# Altium project Laser Power Meter.PrjPcb
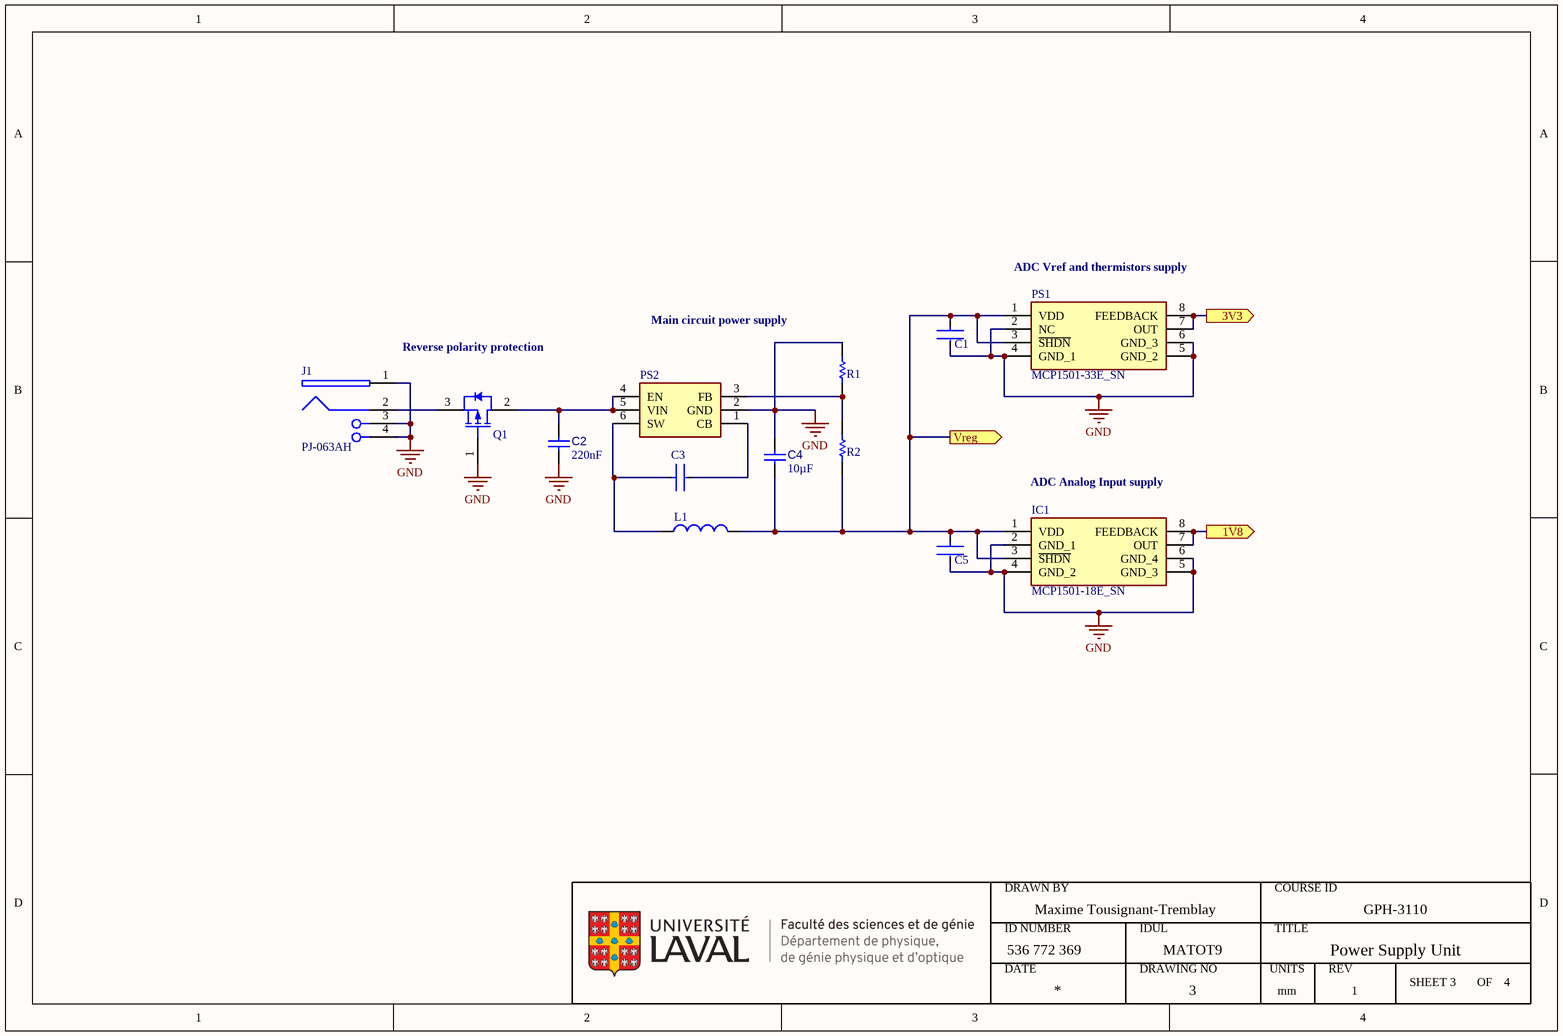
[diagram p0: Power Supply Unit.SchDoc]
Units: mm; SCH_REV: A; PCB_REV: A; PCB_PART_NUMBER: <PCB PN>; PCB_ENGINEER_APP_DATE: --/--/----; PCB_ENGINEER: - -----; PCB_DWG_NO: <PCB DWG NO>; PCB_DESIGNER_APP_DATE: --/--/----; PCB_DESIGNER: - -----; PCB_CHECKER_APP_DATE: --/--/----; PCB_CHECKER: - -----; PCB_ASSEMBLY_NO: <PCB ASSY NO>; PCB_ANG_TOL: +/-1/2; PCB_3_DEC_TOL: +/-.010; PCB_2_DEC_TOL: +/-.01; IDUL: MATOT9; ID Number: 536 772 369; DrawnBy: Maxime Tousignant-Tremblay; DOC_NO_SCH_DWG: <SCH DWG NO>; DOC_NO_FAB_DWG: <FAB DWG NO>; DOC_NO_BOM: <BOM DOC NO>; DOC_NO_ASSY_DWG: <ASSY DWG NO>; CourseID: GPH-3110; CONTRACT_NUMBER: <CONTRACT NO>; CAGE_CODE: ?????
6 sheets, 85 parts. Net scope: flat (ports and power ports of the same name join across sheets).
Board file: Design III.PcbDoc
Sheets:
  Power Supply Unit.SchDoc
  Instrumentation Amplifier Design.SchDoc
  Analog Filter-ADC interface.SchDoc
  All in One.SchDoc
  Weatstone Bridge Design.SchDoc
  Voltage Divider Design.SchDoc

## Sheet Power Supply Unit.SchDoc: Power Supply Unit
size A4; DrawnBy: Maxime Tousignant-Tremblay; DocumentNumber: GPH-3110-1; Revision: 1; SheetNumber: 3; SheetTotal: 4; SPICEModelCacheSEIOAEZJ: <root> / <DocumentId>SEIOAEZJ</DocumentId> / </root>

### Parts
(Parts that share a designator on the sheet are numbered #1, #2 ... from top to bottom, then left to right.)
*1#1  ULaval FSG-DPGPO  (value not drawn)
C1#1  CL10A225KO8NNNC  [FP-CL10-IPC_A]  (value not drawn)
C2#1  value 220nF  [CAPC0402(1005)60_L]  (hidden comment: Capacitor 220nF +/-20% 10V 0402)
C3#1  CC0603KRX7R9BB104  [FP-CC0603-DA-MFG]  (value not drawn)
C4#1  value 10µF  [CAPC2013X135X45NL10T25]  (hidden comment: Capacitor 10 uF +/- 10% 16 V 0805)
C5#1  CL10A225KO8NNNC  [FP-CL10-IPC_A]  (value not drawn)
IC1  MCP1501-18E_SN  [SOIC127P600X175-8N]
J1#1  PJ-063AH  [CUI-PJ-063AH_V]
L1#1  7447916  [SMD-1210]  (value not drawn)
PS1  MCP1501-33E_SN  [SOIC127P600X175-8N]
PS2  LMR50410YFQDBVRQ1  [SOT95P280X145-6N]  (value not drawn)
Q1#1  IPD90P03P4-04  [INF-PG-TO252-3-11_N]  (value not drawn)
R1#1  RC0402FR-1322K1L  [RESC1005X40X25ML05T10]  (value not drawn)
R2#1  RC0402FR-0788K7L  [RESC1005X40X25NL05T10]  (value not drawn)

### Ports
1V8 (out, see Processing interface[1A], Processing interface[1B], Processing interface[1C], Processing interface[4A], Processing interface[4B], Processing interface[4C]), 3V3 (out, see Processing interface[1A], Processing interface[1B], Processing interface[1C], Processing interface[4A], Processing interface[4B], Processing interface[4C], Weatstone bridge[2B]), Vreg (out, see Processing interface[1A], Processing interface[1B], Processing interface[1C], Processing interface[3C], Processing interface[4A], Processing interface[4B], Processing interface[4C], Processing interface[4D], Weatstone bridge[2B], Weatstone bridge[2C], Weatstone bridge[3B])

### Nets
GND: C1#1.2 C2#1.2 C4#1.2 C5#1.2 IC1.2(GND_1) IC1.4(GND_2) IC1.5(GND_3) IC1.6(GND_4) J1#1.1 J1#1.3(SHLD) J1#1.4(SHLD) PS1.2(NC) PS1.4(GND_1) PS1.5(GND_2) PS1.6(GND_3) PS2.2(GND) Q1#1.1(GATE) R1#1.2
NetC1#1_1: C1#1.1 C4#1.1 C5#1.1 IC1.1(VDD) IC1.3(~{SHDN}) L1#1.2 PS1.1(VDD) PS1.3(~{SHDN}) R2#1.1 ; port Vreg
NetC2#1_1: C2#1.1 PS2.4(EN) PS2.5(VIN) Q1#1.2(DRAIN)
NetC3#1_1: C3#1.1 L1#1.1 PS2.6(SW)
NetC3#1_2: C3#1.2 PS2.1(CB)
NetIC1_7: IC1.7(OUT) IC1.8(FEEDBACK) ; port 1V8
NetJ1#1_2: J1#1.2 Q1#1.3(SOURCE)
NetPS1_7: PS1.7(OUT) PS1.8(FEEDBACK) ; port 3V3
NetPS2_3: PS2.3(FB) R1#1.1 R2#1.2

### Notes on the sheet
- (near PS1) ADC Vref and thermistors supply
- Reverse polarity protection
- Main circuit power supply
- (near IC1) ADC Analog Input supply
- (in symbol ULaval FSG-DPGPO) DRAWN BY; COURSE ID; ID NUMBER; IDUL; TITLE; DATE; DRAWING NO; UNITS; REV; SHEET; OF

### Library data of the parts
C1#1 C5#1 = CMP-13271-000835-1: Cap Ceramic 2.2uF 16V X5R ±10% Pad SMD 0603 +85°C T/R; Case Code (Metric): 1608; Height: 0.8mm; Case/Package: 0603; Depth: 0.8mm; Capacitance: 2.2uF; Voltage Rating: 16V; Case Code (Imperial): 0603; Length: 1.6mm; Packaging: Tape and Reel; Material: Ceramic; Lead Free: Lead Free; Max Operating Temperature: 85°C; Contact Plating: Tin; Thickness: 0.035inch; Radiation Hardening: No; Tolerance: 10%; Min Operating Temperature: -55°C; Voltage: 16V; Dielectric: X5R; Mount: Surface Mount; Package Quantity: 4000; Width: 0.031inch; Voltage Rating (DC): 16V
C2#1 = CMP-001-00057-3: Chip Capacitor, 220nF +/-20%, 10V, 0402, Thickness 0.6 mm; Tolerance: 10%; Max Operating Temperature: 85°C; Pins: 2; Case/Package: 0402; Mounting Technology: SMT; Voltage Rating: 10V; Min Operating Temperature: -55°C
C3#1 = CMP-2100-03601-2: CAP CER 0.1UF 50V X7R 0603; Manufacturer: YAGEO; Material: Ceramic; Capacitance: 100 nF; Temperature Coefficient: 15%; Tolerance: 0.1; Value: 100 nF; Description: CC0603 100 nF X7R 10.00% 50 V; Height: 0.9mm; Voltage: 50 V; ComponentLink2Description: Datasheet; Device Class L2: Capacitors; Temperature Range High: +125°C; Category: Cap; Footprint Url: http://www.yageo.com/exep/pages/download/literatures/UPY-C_GEN_24.pdf; ComponentLink2URL: http://www.yageo.com/documents/recent/UPY-GPHC_X7R_6.3V-to-50V_18.pdf; Package: CC0603-DA; Temperature: -55°C to +125°C; Voltage Rating: 50 V; Temperature Characteristic: X7R; Device Class L1: Passive Components; Temperature Range Low: -55°C; Manufacturer Part Number: CC0603KRX7R9BB104; RoHS: TRUE; Automotive: No; Device Class L3: Ceramic Capacitors; Octopart: https://octopart.com/cc0603krx7r9bb104-yageo-42244635; Mouser Description: Multilayer Ceramic Capacitor, CC Series, 0.1 - F, - 10%, X7R, 50 V, 0603 [1608 Metric]; Lead Free: Yes; Digikey Description: CAP CER 0.1UF 50V X7R 0603
C4#1 = CMP-001-00015-6: Chip Capacitor, 10 uF, +/- 10%, 16 V, 0805 (2012 Metric); Voltage Rating: 16V; Capacitor Type: Ceramic; RoHS Compliant: True; Max Operating Temperature: 85°C; Min Operating Temperature: -55°C; Mounting Technology: SM; Tolerance: 10%; Case/Package: 0805; Pins: 2
IC1 = MCP1501-18E_SN: Integrated Circuit; Manufacturer_Name: Microchip; Manufacturer_Part_Number: MCP1501-18E/SN; Datasheet Link: http://ww1.microchip.com/downloads/en/DeviceDoc/20005474E.pdf; Height: 1.75mm; Mouser Part Number: 579-MCP1501-18E/SN; Mouser Price/Stock: https://www.mouser.co.uk/ProductDetail/Microchip-Technology-Atmel/MCP1501-18E-SN?qs=BA62vJVifGrqbCLW75KQyA%3D%3D; Arrow Part Number: MCP1501-18E/SN; Arrow Price/Stock: https://www.arrow.com/en/products/mcp1501-18esn/microchip-technology?region=nac
J1#1 = CMP-2000-06898-1: Through Hole Right Angle DC Power Jack, 8 A, 2 mm Center Pin, 2 Position, -25 to 85 degC, RoHS, Bulk; Manufacturer: CUIInc.; Voltage Rating: 24V; Current Rating: 8A; Inside Contact Diameter: 2mm; Insulation Resistance: 100MOhms; Outside Contact Diameter: 6.5mm; Brand: CUI; Termination Style: ThroughHole; Flammability Rating: UL94V-0; Datasheet Version: Rev. 1.02, 03/2016; Manufacturer URL: http://www.cui.com/; Product Category: DCPowerConnectors; Package Description: 2-Pin Through Hole Device, Body 13 x 10 mm, Height 9 mm; Connector Type: DCPowerJack; Factory Pack Quantity: 500; Contact Plating: Nickel; Mounting Style: KinkedPin; Contact Material: Copper; RoHS: True; Mounting Angle: Right; Package Reference: PJ-063AH; Product: Jacks; Contact Gender: Male; Datasheet URL: http://www.cui.com/product/resource/pj-063ah.pdf; Housing Material: PolybutyleneTerephthalate(PBT); Mounting Technology: ThroughHole; Operating Temperature Range: -25Cto+85C
L1#1 = CMP-0221-00031-1: SMD-Multilayer Inductor WE-MI, L = 4.70 µH; Inductance: 4.70 ÂµH; ComponentLink2Description: Datasheet; PackageReference: SMD-1210; ComponentLink1Description: Manufacturer Link; PackageDescription: Chip Inductor, 2-Leads, Body 3.2 x 2.5 mm; PackageVersion: 2007; ComponentLink1URL: http://www.we-online.com; DatasheetVersion: ver 5, Oct-2004; ComponentLink2URL: http://www.we-online.de/katalog/media/pdf/7447916.pdf
PS1 = MCP1501-33E_SN: Power Supply; Manufacturer_Name: Microchip; Manufacturer_Part_Number: MCP1501-33E/SN; Datasheet Link: http://www.farnell.com/datasheets/2158574.pdf; Height: 1.75mm; Mouser Part Number: 579-MCP1501-33E/SN; Mouser Price/Stock: https://www.mouser.co.uk/ProductDetail/Microchip-Technology-Atmel/MCP1501-33E-SN?qs=BA62vJVifGoOZffNI8tq9A%3D%3D; Arrow Part Number: MCP1501-33E/SN; Arrow Price/Stock: https://www.arrow.com/en/products/mcp1501-33esn/microchip-technology?region=nac
PS2 = LMR50410YFQDBVRQ1: Power Supply; Manufacturer_Name: Texas Instruments; Datasheet Link: https://www.ti.com/product/LMR50410-Q1; Height: 1.45mm; Manufacturer_Part_Number: LMR50410YFQDBVRQ1; Mouser Part Number: 595-MR50410YFQDBVRQ1; Mouser Price/Stock: https://www.mouser.co.uk/ProductDetail/Texas-Instruments/LMR50410YFQDBVRQ1?qs=81r%252BiQLm7BRUAgUFqYZycA%3D%3D; Arrow Part Number: LMR50410YFQDBVRQ1; Arrow Price/Stock: https://www.arrow.com/en/products/lmr50410yfqdbvrq1/texas-instruments?region=nac
Q1#1 = CMP-013-00034-1: Single P-Channel 30 V 4.5 mOhm 100 nC OptiMOS Power Mosfet - TO-252-3-11; Gate to Source Voltage (Vgs): 20V; Input Capacitance: 10.3nF; Rds On Max: 4.5mR; Drain to Source Breakdown Voltage: 30V; Power Dissipation: 137W; Max Dual Supply Voltage: -30V; Continuous Drain Current (ID): 90A; Turn-Off Delay Time: 70ns; Halogen Free: Halogen Free; Min Operating Temperature: -55°C; RoHS Compliant: Yes; Max Operating Temperature: 175°C; Pins: 3; Lead Free: Lead Free; Packaging: Tape and Reel; Package Quantity: 1; Reach SVHC Compliant: Yes; Drain to Source Voltage (Vdss): -30V; Max Power Dissipation: 137W; Element Configuration: Single; Drain to Source Resistance: 4.5mR; Series: OptiMOS™; Case/Package: TO-252-3
R1#1 = CMP-2002-07868-1: Manufacturer: Yageo / Phycomp; Part Number: RC0402FR-1322K1L
R2#1 = CMP-2002-07828-1: Manufacturer: Yageo; Part Number: RC0402FR-0788K7L

## Sheet Instrumentation Amplifier Design.SchDoc: Instrumentation Amplifier Design
size A4; DocumentNumber: GPH-3110-5; Revision: 1; SheetNumber: 2; SheetTotal: 6
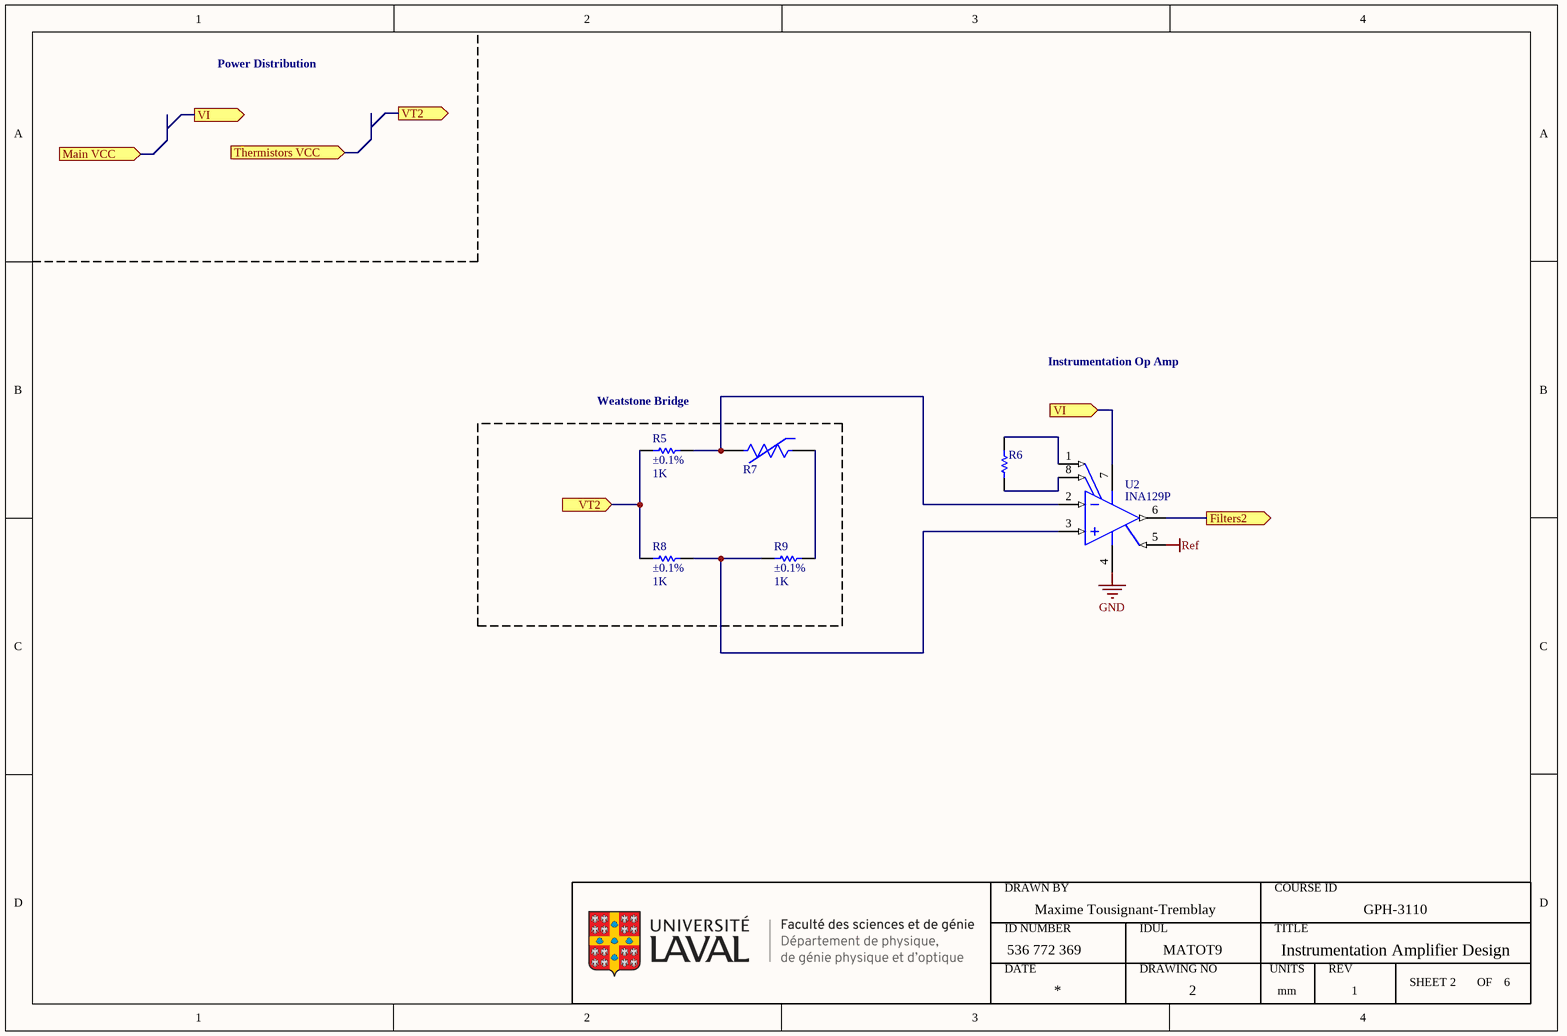
[diagram p1: Instrumentation Amplifier Design.SchDoc]

### Parts
(Parts that share a designator on the sheet are numbered #1, #2 ... from top to bottom, then left to right.)
*2  ULaval FSG-DPGPO  (value not drawn)
R5#1  value 1K  TC: ±0.1%  (hidden comment: Resistor)
R6#1  Resistor  (value not drawn)
R7#1  TMP6131DYAT  [FP-DYA0002A-MFG]  (value not drawn)
R8#1  value 1K  TC: ±0.1%  (hidden comment: Resistor)
R9#1  value 1K  TC: ±0.1%  (hidden comment: Resistor)
U2#1  INA129P  [P0008A]

### Blocks framed on the sheet
Weatstone Bridge: R5#1 R7#1 R8#1 R9#1

### Ports
Filters2 (out), Main VCC (in), Thermistors VCC (in), VI (in), VI (out), VT2 (in), VT2 (out)

### Nets
GND: U2#1.4(V-)
Ref: U2#1.5(REF)
NetR5#1_1: R5#1.1 R7#1.1(-) U2#1.2(VIN-)
NetR5#1_2: R5#1.2 R8#1.2 ; port VT2
NetR6#1_1: R6#1.1 U2#1.8(RG)
NetR6#1_2: R6#1.2 U2#1.1(RG)
NetR7#1_2: R7#1.2(+) R9#1.1
NetR8#1_1: R8#1.1 R9#1.2 U2#1.3(VIN+)
NetU2#1_6: U2#1.6(VO) ; port Filters2
NetU2#1_7: U2#1.7(V+) ; port VI

### Notes on the sheet
- Power Distribution
- Instrumentation Op Amp
- (in symbol ULaval FSG-DPGPO) DRAWN BY; COURSE ID; ID NUMBER; IDUL; TITLE; DATE; DRAWING NO; UNITS; REV; SHEET; OF

### Library data of the parts
R5#1 R8#1 R9#1 = Resistor: TC1: 0; SimulationGenericComponent: True; TC2: 0
R6#1 = Resistor: TC1: 0; SimulationGenericComponent: True; Value: 1K; TC2: 0
R7#1 = CMP-009-00177-1: ±1% tolerance 10kΩ linear thermistor available in 0402 and 0603 package options 2-SOT-5X3 -40 to 125; Max Operating Temperature: 125°C; Mounting Technology: Surface Mount; Min Operating Temperature: -40°C; Series: -; Resistance Tolerance: 1%
U2#1 = CMP-014-00009-1: Precision, Low Power Instrumentation Amplifiers 8-PDIP; Common Mode Rejection Ratio: 120dB; Supply Current: 750uA; -3db Bandwidth: 1.3MHz; Input Bias Current: 5nA; Output Current per Channel: 15mA; Number of Channels: 1; Input Voltage Noise Density: 8nV/sqrt Hz; Input Resistance: 100GR; Voltage Gain: 80dB; Number of Elements: 3; Dual Supply Voltage: 15V; Slew Rate: 4V/µs; Min Dual Supply Voltage: 2.25V; Max Dual Supply Voltage: 18V; Operating Supply Current: 700uA; Min Supply Voltage: 4.5V; Input Offset Voltage (Vos): 50uV; Max Supply Voltage: 36V; RoHS Compliant: Yes; Min Operating Temperature: -40°C; Gain Bandwidth Product: 1.3MHz; Weight: 0.018646oz; Length: 9.81mm; Width: 6.35mm; Series: INA129; Pins: 8; Max Operating Temperature: 125°C; Number of Amplifiers: 1; Nominal Supply Current: 750uA; Packaging: Rail/Tube; Bandwidth: 1.3MHz; Height: 4.57mm; Case/Package: P; Lead Free: Lead Free; Quiescent Current: 700uA; Reach SVHC Compliant: Yes; Package Quantity: 50; Number of Circuits: 1; Radiation Hardening: No

## Sheet Analog Filter-ADC interface.SchDoc: Analog Filter-ADC interface
size A4; DocumentNumber: GPH-3110-3; Revision: 1; SheetNumber: 3; SheetTotal: 6; SPICEModelCacheINAKYIWR: <root> / <DocumentId>INAKYIWR</DocumentId> / </root>
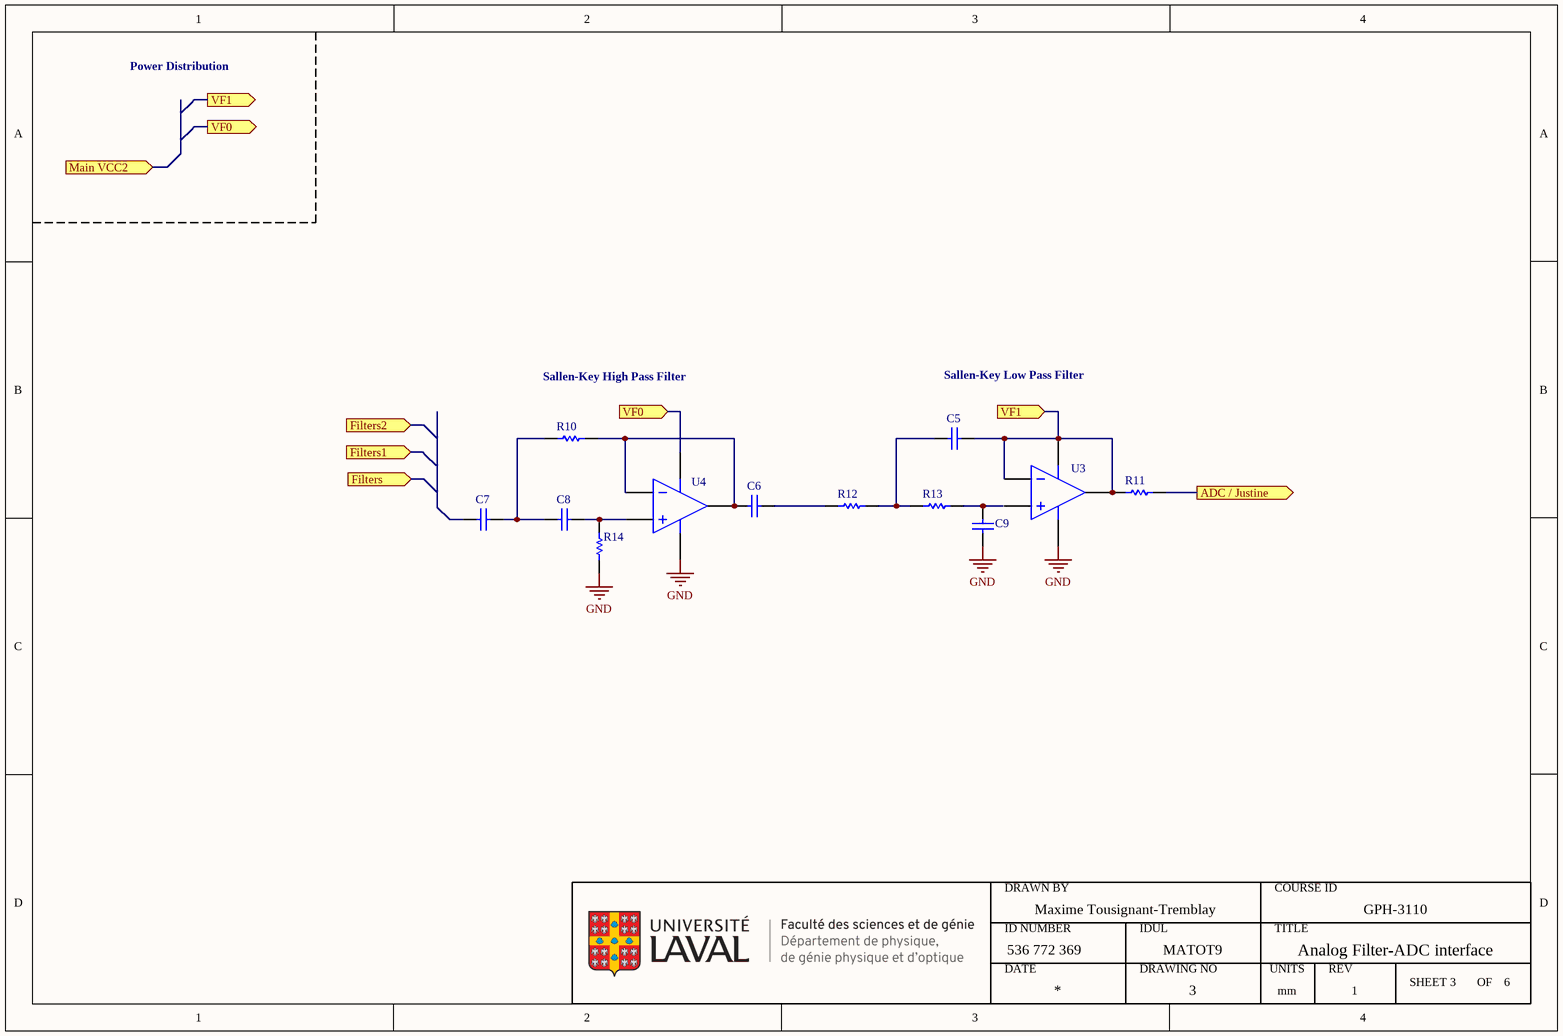
[diagram p2: Analog Filter-ADC interface.SchDoc]

### Parts
(Parts that share a designator on the sheet are numbered #1, #2 ... from top to bottom, then left to right.)
*3  ULaval FSG-DPGPO  (value not drawn)
C5#2  Capacitor  (value not drawn)
C6  Capacitor  (value not drawn)
C7  Capacitor  (value not drawn)
C8  Capacitor  (value not drawn)
C9  Capacitor  (value not drawn)
R10  Resistor  (value not drawn)
R11  Resistor  (value not drawn)
R12  Resistor  (value not drawn)
R13  Resistor  (value not drawn)
R14  Resistor  (value not drawn)
U3#1  Ideal Operational Amplifier  (value not drawn)
U4  Ideal Operational Amplifier  (value not drawn)

### Ports
ADC / Justine (out), Filters1 (in), Filters2 (in), Filters (in), Main VCC2 (in), VF0 (in), VF0 (out), VF1 (in), VF1 (out)

### Nets
GND: C9.2 R14.1 U3#1.5(V-) U4.5(V-)
NetC5#2_1: C5#2.1 R12.2 R13.2
NetC5#2_2: C5#2.2 R11.2 U3#1.1(IN-) U3#1.3(OUT) U3#1.4(V+) ; port VF1
NetC6_1: C6.1 R12.1
NetC6_2: C6.2 R10.2 U4.1(IN-) U4.3(OUT)
NetC7_2: C7.2 C8.1 R10.1
NetC8_2: C8.2 R14.2 U4.2(IN+)
NetC9_1: C9.1 R13.1
NetR11_1: R11.1 ; port ADC / Justine
NetU4_4: U4.4(V+) ; port VF0

Not connected (* = marked no-connect by the designer): C7 1; U3#1 2(IN+)

### Notes on the sheet
- Power Distribution
- Sallen-Key High Pass Filter
- Sallen-Key Low Pass Filter
- (in symbol ULaval FSG-DPGPO) DRAWN BY; COURSE ID; ID NUMBER; IDUL; TITLE; DATE; DRAWING NO; UNITS; REV; SHEET; OF

### Library data of the parts
C5#2 C6-C9 = Capacitor: SimulationGenericComponent: True; Value: 1p
R10-R14 = Resistor: as R6#1 on sheet Instrumentation Amplifier Design; TC2: 0
U3#1 U4 = OpAmp with power terminals: SimulationGenericComponent: True; GAIN: 1

## Sheet All in One.SchDoc: All in One
size A4; Revision: 1; SheetNumber: 2; SheetTotal: 3; SPICEModelCacheWHRBMNBV: <root> / <DocumentId>WHRBMNBV</DocumentId> / <CacheFrame Number="0"> / <Model Name="pmos" Kind="MDL"> / <Text>*Default P-Channel MOSFET / *Pinout: D,G,S / .MODEL PMOS PMOS()</Text> / </Model> / </CacheFrame> / </root>
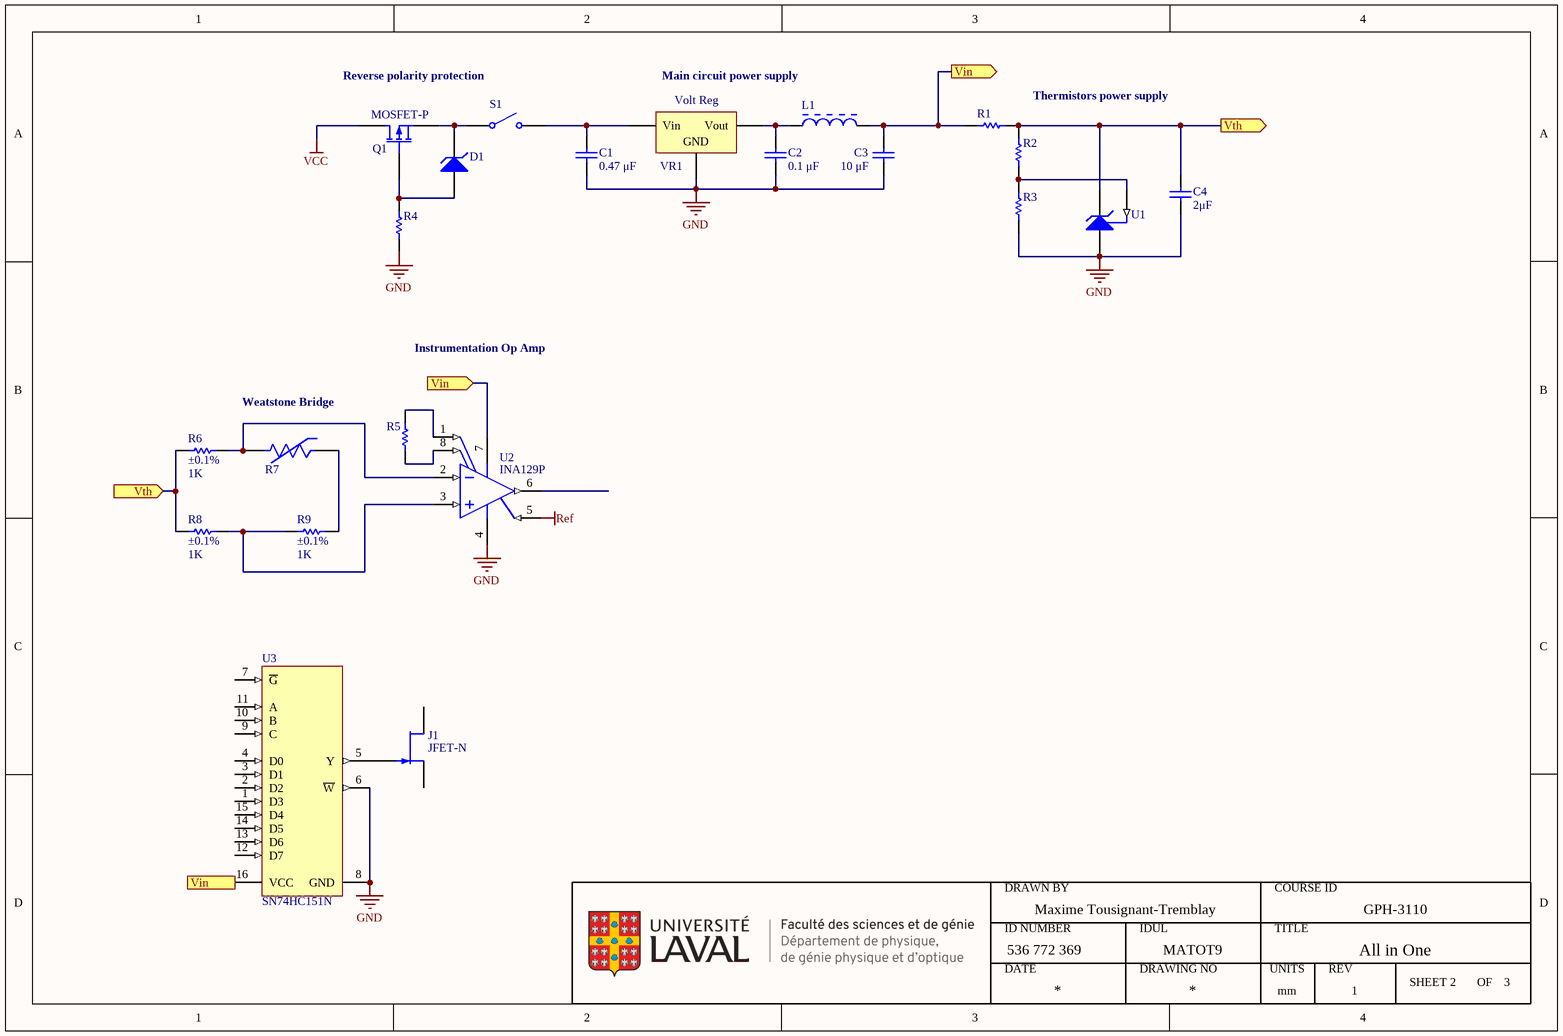
[diagram p3: All in One.SchDoc]

### Parts
(Parts that share a designator on the sheet are numbered #1, #2 ... from top to bottom, then left to right.)
*1#2  ULaval FSG-DPGPO  (value not drawn)
C1#2  value 0.47 μF  (hidden comment: Capacitor)
C2#2  value 0.1 μF  (hidden comment: Capacitor)
C3#2  value 10 μF  (hidden comment: Capacitor)
C4#2  value 2μF  (hidden comment: Capacitor)
D1  Zener Diode  (value not drawn)
J1#2  JFET-N
L1#2  BL01RN1A1D2B  [INDA65-500X360]  (value not drawn)
Q1#2  MOSFET-P  [E3]
R1#2  Resistor  (value not drawn)
R2#2  Resistor  (value not drawn)
R3  Resistor  (value not drawn)
R4  Resistor  (value not drawn)
R5#2  Resistor  (value not drawn)
R6#2  value 1K  TC: ±0.1%  (hidden comment: Resistor)
R7#2  TMP6131DYAT  [FP-DYA0002A-MFG]  (value not drawn)
R8#2  value 1K  TC: ±0.1%  (hidden comment: Resistor)
R9#2  value 1K  TC: ±0.1%  (hidden comment: Resistor)
S1  Single-Pole, Single-Throw Switch  (value not drawn)
U1  TL431AILPR  [LP0003A]  (value not drawn)
U2#2  INA129P  [P0008A]
U3#2  SN74HC151N  [N0016A]
VR1  Volt Reg  [D2PAK_N]

### Ports
Vin (in, see All in One[1D], All in One[3A]), Vin (in, see All in One[2B], All in One[3A]), Vin (out, see All in One[1D], All in One[2B]), Vth (in, see All in One[4A]), Vth (out, see All in One[1B])

### Nets
GND: C1#2.1 C2#2.1 C3#2.1 C4#2.1 R3.1 R4.1 U1.2(ANODE) U2#2.4(V-) U3#2.6(~{W}) U3#2.8(GND) VR1.2(GND)
Ref: U2#2.5(REF)
VCC: Q1#2.1(D)
NetC1#2_2: C1#2.2 S1.2 VR1.1(Vin)
NetC2#2_2: C2#2.2 L1#2.1 VR1.3(Vout)
NetC3#2_2: C3#2.2 L1#2.2 R1#2.2 U2#2.7(V+) U3#2.16(VCC) ; port Vin
NetC4#2_2: C4#2.2 R1#2.1 R2#2.2 R6#2.2 R8#2.2 U1.3(CATHODE) ; port Vth
NetD1_1: D1.1(A) Q1#2.2(G) R4.2
NetD1_2: D1.2(K) Q1#2.3(S) S1.1
NetJ1#2_2: J1#2.2(G) U3#2.5(Y)
NetR2#2_1: R2#2.1 R3.2 U1.1(REF)
NetR5#2_1: R5#2.1 U2#2.8(RG)
NetR5#2_2: R5#2.2 U2#2.1(RG)
NetR6#2_1: R6#2.1 R7#2.1(-) U2#2.2(VIN-)
NetR7#2_2: R7#2.2(+) R9#2.1
NetR8#2_1: R8#2.1 R9#2.2 U2#2.3(VIN+)

Not connected (* = marked no-connect by the designer): J1#2 1(D) 3(S); U2#2 6(VO); U3#2 1(D3) 2(D2) 3(D1) 4(D0) 7(~{G}) 9(C) 10(B) 11(A) 12(D7) 13(D6) 14(D5) 15(D4)

### Notes on the sheet
- Reverse polarity protection
- Main circuit power supply
- Thermistors power supply
- Instrumentation Op Amp
- Weatstone Bridge
- (in symbol ULaval FSG-DPGPO) DRAWN BY; COURSE ID; ID NUMBER; IDUL; TITLE; DATE; DRAWING NO; UNITS; REV; SHEET; OF

### Library data of the parts
C1#2 C2#2 C3#2 C4#2 = Capacitor: SimulationGenericComponent: True
D1 = Zener Diode: AF: 1; BV_MAX: 1e99; CJO: 0; EG: 1.11; FC: 0.5; IBV: 0.001; IS: 1e-14; MJSW: 0.33; NTUN: 30; TNOM: 27; XTI: 3; SimulationGenericComponent: True; BV: 100; CJP: 0; CTA: 0; CTP: 0; FCS: 0.5; FV_MAX: 1e99; IKF: 0; IKR: 0; ISR: 1e-14; JSW: 0; JTUN: 0; JTUNSW: 0; KEG: 1; KF: 0; LEVEL: 1; N: 1; NBV: 1; NR: 1; NS: 1; PHP: 1; RS: 0; TCV: 0; TLEV: 0; TLEVC: 0; TM1: 0; TM2: 0; TPB: 0; TPHP: 0; TRS: 0; TRS2: 0; TT: 0; TTT1: 0; TTT2: 0; VJ: 1; XTITUN: 3
J1#2 = JFET N-ch Level1: N-channel Junction gate Field-Effect Transistor Level1; AF: 1; BETA: 0.0001; BEX: 0; FC: 0.5; IS: 1e-14; NLEV: 2; TNOM: 27; VT0: -2; SimulationGenericComponent: True; B: 1; CGD: 0; CGS: 0; GDSNOI: 1; KF: 0; LAMBDA: 0; PB: 1; RD: 0; RS: 0; TCV: 0
L1#2 = CMP-006-00003-3: EMI Suppression Filter (Lead Type EMIFIL(R)), 7 A, -40 to 85 degC, 2-Pin THD, RoHS, Bulk; Manufacturer: Murata; Impedance: 50Ohm; Current Rating: 7A; Core Material: Ferrite; Packaging: Bulk; Package Reference: INDA65-500X360; Case/Package: Axial; Datasheet URL: http://www.murata.com/en-us/products/productdata/8796738977822/ENFA0005.pdf; Package Quantity: 500; Diameter: 3.6mm; Datasheet Version: May-16; Min Operating Temperature: -40°C; Mounting Technology: TH; RoHS Compliant: True; Package Description: 2-Pin Axial Lead, Dia 3.6 mm, Body Length 5 mm; Max Operating Temperature: 85°C; Pins: 2; Max Current Rating: 7A
Q1#2 = MOSFET-P: P-Channel MOSFET; Published: 8-Jun-2000; LatestRevisionDate: 17-Jul-2002; LatestRevisionNote: Re-released for DXP Platform.; PackageVersion: 1995/1996; PackageReference: E3; Publisher: Altium Limited; PackageDescription: TO, Flat Index; 3 In-Line, Axial Leads; Body Dia. 4.6mm; Lead Dia. 0.5 mm (max)
R1#2 R2#2 R3 R4 R5#2 = Resistor: as R6#1 on sheet Instrumentation Amplifier Design; TC2: 0
R6#2 R8#2 R9#2 = Resistor: TC1: 0; SimulationGenericComponent: True; TC2: 0
R7#2 = CMP-009-00177-1: as R7#1 on sheet Instrumentation Amplifier Design; Max Operating Temperature: 125°C; Mounting Technology: Surface Mount; Min Operating Temperature: -40°C; Series: -; Resistance Tolerance: 1%
S1 = SPST SW: closed: 0; Rclosed: 1m; Ropen: 1Meg; SimulationGenericComponent: True
U1 = CMP-019-00054-1: IC VREF SHUNT ADJ TO92-3; Max Output Voltage: 36V; Cathode Current: 700uA; Max Output current: 100mA; Min Input Voltage: 2.495V; Temperature Coefficient: 92ppm/°C; Max Supply Voltage: 37V; Reference Type: Shunt,Adjustable; Tolerance: 1%; Number of Channels: 1; Max Operating Temperature: 125°C; Reach SVHC Compliant: Yes; Weight: 0.00752oz; Case/Package: TO-92-3; RoHS Compliant: Yes; Packaging: Tape and Reel; Lead Free: Lead Free; Package Quantity: 1; Output Voltage: 36V; Output Current: 100mA; Series: -; Reference Voltage: 36V; Min Operating Temperature: -40°C; Pins: 3
U2#2 = CMP-014-00009-1: as U2#1 on sheet Instrumentation Amplifier Design; RoHS Compliant: Yes; Min Operating Temperature: -40°C; Gain Bandwidth Product: 1.3MHz; Weight: 0.018646oz; Length: 9.81mm; Width: 6.35mm; Series: INA129; Pins: 8; Max Operating Temperature: 125°C; Number of Amplifiers: 1; Nominal Supply Current: 750uA; Packaging: Rail/Tube; Bandwidth: 1.3MHz; Height: 4.57mm; Case/Package: P; Lead Free: Lead Free; Quiescent Current: 700uA; Reach SVHC Compliant: Yes; Package Quantity: 50; Number of Circuits: 1; Radiation Hardening: No
U3#2 = CMP-016-00010-1: Multiplexer 1-Element CMOS 8-IN 16-Pin PDIP Tube / IC 8-TO-1 DATA SEL/MUX 16-DIP; Max Supply Voltage: 6V; Propagation Delay: 47ns; Independent Circuits: 1; Number of Input Lines: 8; Operating Supply Voltage: 5V; Bandwidth: 28MHz; Low Level Output Current: 7.8mA; Supply Type: Single; Min Supply Voltage: 2V; Polarity: Non-Inverting; Lead Free: Lead Free; Logic Function: Multiplexer; Height: 4.57mm; Radiation Hardening: No; Pins: 16; Number of Channels: 1; Number of Circuits: 1; Number of Inputs: 8; Number of Output Lines: 1; Weight: 0.03357oz; Mounting Technology: Through Hole; Package Quantity: 25; Min Operating Temperature: -40°C; Number of Bits: 8; Number of Outputs: 1; RoHS Compliant: Yes; Max Operating Temperature: 85°C; Series: 74HC; Width: 6.35mm; Reach SVHC Compliant: Yes; High Level Output Current: 7.8mA; Case/Package: PDIP; Packaging: Rail/Tube; Length: 19.3mm
VR1 = Volt Reg: Voltage Regulator; Published: 24-Mar-1999; LatestRevisionDate: 29-May-2009; LatestRevisionNote: IPC-7351 Footprint Added.; PackageReference: D2PAK; Publisher: Altium Limited; PackageDescription: 3-Pin Transistor Outline Package 2.54 mm Pitch, 15.1 mm Lead Span

## Sheet Weatstone Bridge Design.SchDoc: Weatstone Bridge Design
size A4; DocumentNumber: GPH-3110-4; Revision: 1; SheetNumber: 5; SheetTotal: 6; SPICEModelCacheOCUZZWQD: <root> / <DocumentId>OCUZZWQD</DocumentId> / <CacheFrame Number="0"> / <Model Name="nmos" Kind="MDL"> / <Text>*Default N-Channel MOSFET / *Pinout: D,G,S / .MODEL NMOS NMOS()</Text> / </Model> / </CacheFrame> / </root>
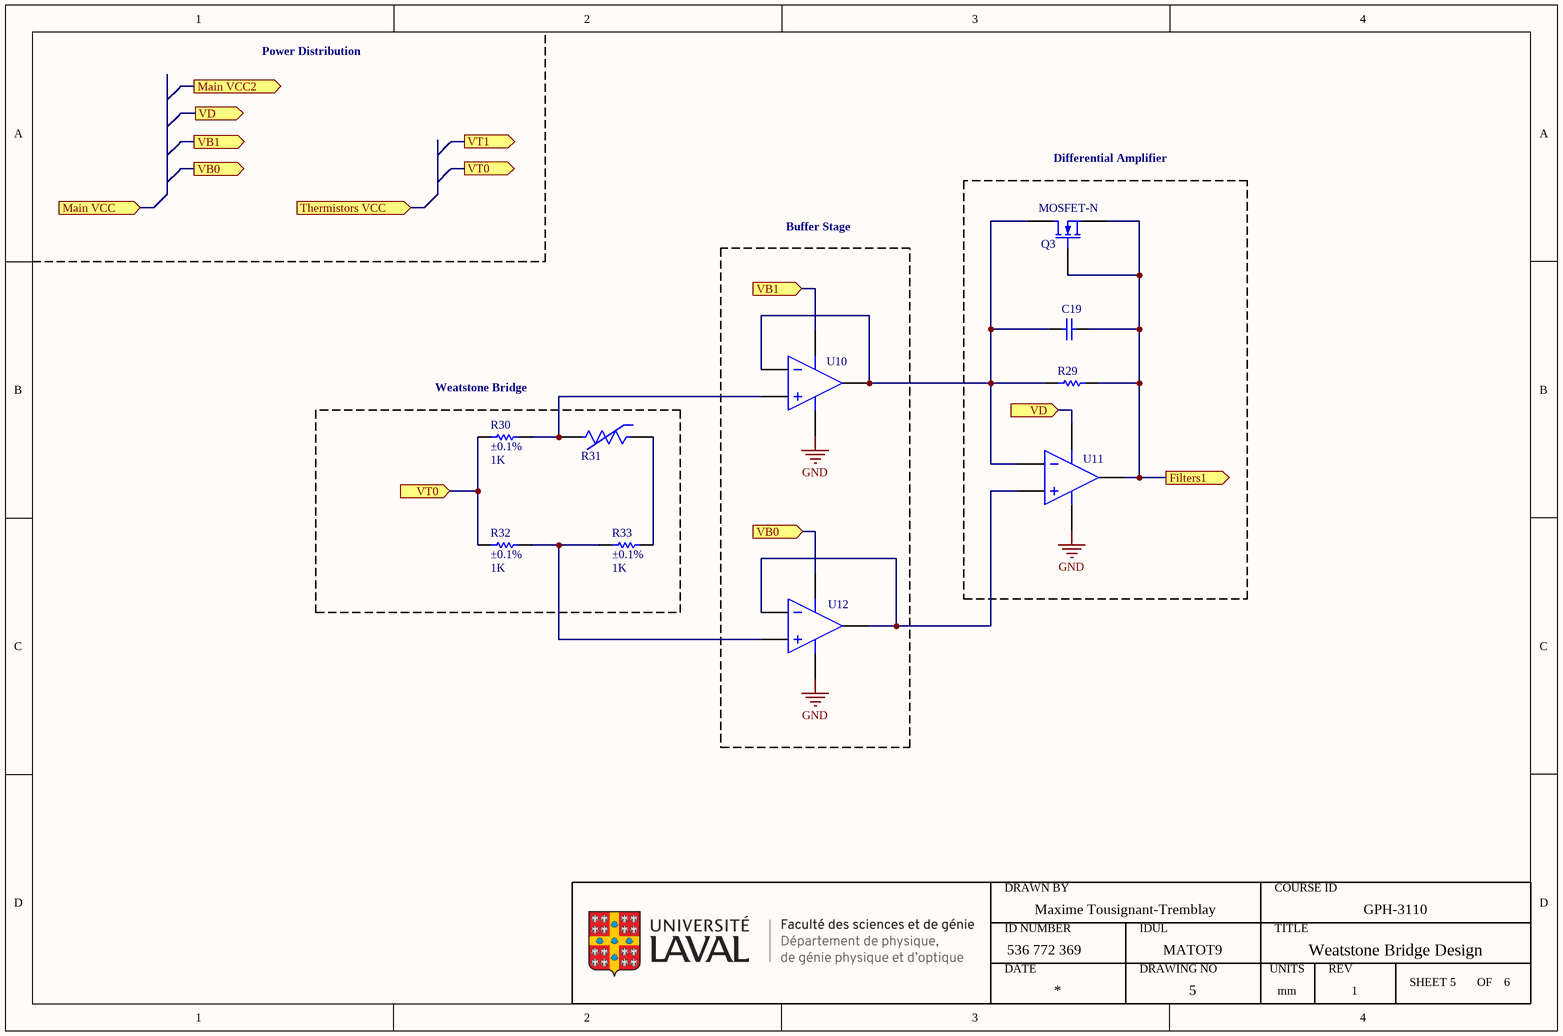
[diagram p4: Weatstone Bridge Design.SchDoc]

### Parts
*5  ULaval FSG-DPGPO  (value not drawn)
C19  Capacitor  (value not drawn)
Q3  MOSFET-N  [E3]
R29  Resistor  (value not drawn)
R30  value 1K  TC: ±0.1%  (hidden comment: Resistor)
R31  TMP6131DYAT  [FP-DYA0002A-MFG]  (value not drawn)
R32  value 1K  TC: ±0.1%  (hidden comment: Resistor)
R33  value 1K  TC: ±0.1%  (hidden comment: Resistor)
U10  Ideal Operational Amplifier  (value not drawn)
U11  Ideal Operational Amplifier  (value not drawn)
U12  Ideal Operational Amplifier  (value not drawn)

### Blocks framed on the sheet
Differential Amplifier: C19 Q3 R29 U11
Buffer Stage: U10 U12
Weatstone Bridge: R30-R33

### Ports
Filters1 (out), Main VCC2 (out), Main VCC (in), Thermistors VCC (in), VB0 (in), VB0 (out), VB1 (in), VB1 (out), VD (in), VD (out), VT0 (in), VT0 (out), VT1 (out)

### Nets
GND: U10.5(V-) U11.5(V-) U12.5(V-)
NetC19_1: C19.1 Q3.1(D)
NetC19_2: C19.2 Q3.2(G) Q3.3(S) R29.2 U11.3(OUT) ; port Filters1
NetR29_1: R29.1 U10.1(IN-) U10.3(OUT) U11.1(IN-)
NetR30_1: R30.1 R31.1(-) U10.2(IN+)
NetR30_2: R30.2 R32.2 ; port VT0
NetR31_2: R31.2(+) R33.1
NetR32_1: R32.1 R33.2 U12.2(IN+)
NetU10_4: U10.4(V+) ; port VB1
NetU11_2: U11.2(IN+) U12.1(IN-) U12.3(OUT)
NetU11_4: U11.4(V+) ; port VD
NetU12_4: U12.4(V+) ; port VB0

### Notes on the sheet
- Power Distribution
- (in symbol ULaval FSG-DPGPO) DRAWN BY; COURSE ID; ID NUMBER; IDUL; TITLE; DATE; DRAWING NO; UNITS; REV; SHEET; OF

### Library data of the parts
C19 = Capacitor: as C5#2 on sheet Analog Filter-ADC interface
Q3 = MOSFET-N: N-Channel MOSFET; Published: 8-Jun-2000; LatestRevisionDate: 17-Jul-2002; LatestRevisionNote: Re-released for DXP Platform.; PackageVersion: 1995/1996; PackageReference: E3; Publisher: Altium Limited; PackageDescription: TO, Flat Index; 3 In-Line, Axial Leads; Body Dia. 4.6mm; Lead Dia. 0.5 mm (max)
R29 = Resistor: as R6#1 on sheet Instrumentation Amplifier Design; TC2: 0
R30 R32 R33 = Resistor: TC1: 0; SimulationGenericComponent: True; TC2: 0
R31 = CMP-009-00177-1: as R7#1 on sheet Instrumentation Amplifier Design; Max Operating Temperature: 125°C; Mounting Technology: Surface Mount; Min Operating Temperature: -40°C; Series: -; Resistance Tolerance: 1%
U10-U12 = OpAmp with power terminals: SimulationGenericComponent: True; GAIN: 1Meg

## Sheet Voltage Divider Design.SchDoc: Voltage Divider Design
size A4; DocumentNumber: GPH-3110-2; Revision: 1; SheetNumber: 6; SheetTotal: 6; Drawing Number: GPH-3110-2; SPICEModelCacheKATMMPQX: <root> / <DocumentId>KATMMPQX</DocumentId> / <CacheFrame Number="0"> / <Model Name="nmos" Kind="MDL"> / <Text>*Default N-Channel MOSFET / *Pinout: D,G,S / .MODEL NMOS NMOS()</Text> / </Model> / </CacheFrame> / </root>
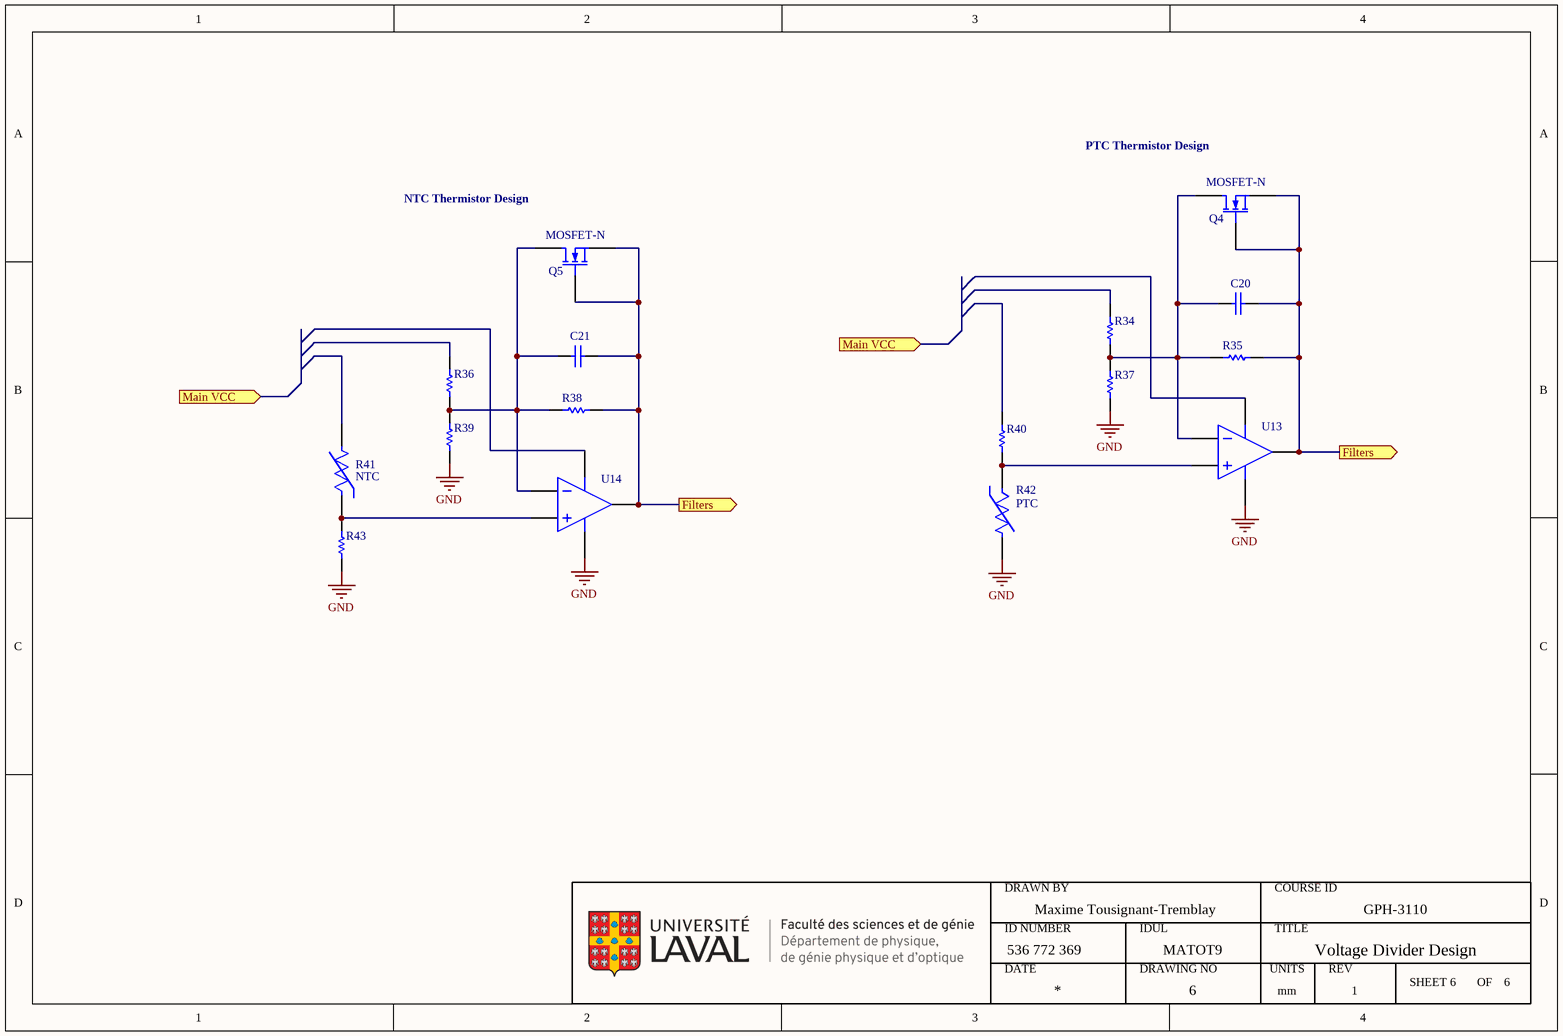
[diagram p5: Voltage Divider Design.SchDoc]

### Parts
*6  ULaval FSG-DPGPO  (value not drawn)
C20  Capacitor  (value not drawn)
C21  Capacitor  (value not drawn)
Q4  MOSFET-N  [E3]
Q5  MOSFET-N  [E3]
R34  Resistor  (value not drawn)
R35  Resistor  (value not drawn)
R36  Resistor  (value not drawn)
R37  Resistor  (value not drawn)
R38  Resistor  (value not drawn)
R39  Resistor  (value not drawn)
R40  Resistor  (value not drawn)
R41  NTC  [FP-DYA0002A-MFG]
R42  PTC  [FP-DYA0002A-MFG]
R43  Resistor  (value not drawn)
U13  Ideal Operational Amplifier  (value not drawn)
U14  Ideal Operational Amplifier  (value not drawn)

### Ports
Filters (out), Main VCC (in)

### Nets
GND: R37.1 R39.1 R42.1(-) R43.1 U13.5(V-) U14.5(V-)
NetC20_1: C20.1 Q4.1(D) R34.2 R35.1 R37.2 U13.1(IN-)
NetC20_2: C20.2 C21.2 Q4.2(G) Q4.3(S) Q5.2(G) Q5.3(S) R35.2 R38.2 U13.3(OUT) U14.3(OUT) ; port Filters
NetC21_1: C21.1 Q5.1(D) R36.2 R38.1 R39.2 U14.1(IN-)
NetR40_1: R40.1 R42.2(+) U13.2(IN+)
NetR41_2: R41.2(+) R43.2 U14.2(IN+)

Not connected (* = marked no-connect by the designer): R34 1; R36 1; R40 2; R41 1(-); U13 4(V+); U14 4(V+)

### Notes on the sheet
- (near Q4) PTC Thermistor Design
- (near Q5) NTC Thermistor Design
- (in symbol ULaval FSG-DPGPO) DRAWN BY; COURSE ID; ID NUMBER; IDUL; TITLE; DATE; DRAWING NO; UNITS; REV; SHEET; OF

### Library data of the parts
C20 C21 = Capacitor: as C5#2 on sheet Analog Filter-ADC interface
Q4 Q5 = MOSFET-N: N-Channel MOSFET; Published: 8-Jun-2000; LatestRevisionDate: 17-Jul-2002; LatestRevisionNote: Re-released for DXP Platform.; PackageVersion: 1995/1996; PackageReference: E3; Publisher: Altium Limited; PackageDescription: TO, Flat Index; 3 In-Line, Axial Leads; Body Dia. 4.6mm; Lead Dia. 0.5 mm (max)
R34-R40 R43 = Resistor: as R6#1 on sheet Instrumentation Amplifier Design; TC2: 0
R41 R42 = CMP-009-00177-1: as R7#1 on sheet Instrumentation Amplifier Design; Max Operating Temperature: 125°C; Mounting Technology: Surface Mount; Min Operating Temperature: -40°C; Series: -; Resistance Tolerance: 1%
U13 U14 = OpAmp with power terminals: as U10 on sheet Weatstone Bridge Design

## Nets that join several sheets
GND: Power Supply Unit (18 pins), Instrumentation Amplifier Design (U2#1.4), Analog Filter-ADC interface (C9.2 R14.1 U3#1.5 U4.5), All in One (11 pins), Weatstone Bridge Design (U10.5 U11.5 U12.5), Voltage Divider Design (6 pins)
Ref: Instrumentation Amplifier Design (U2#1.5), All in One (U2#2.5)